# EAGLE design DiamondOutreach (EAGLE 7.6.0)
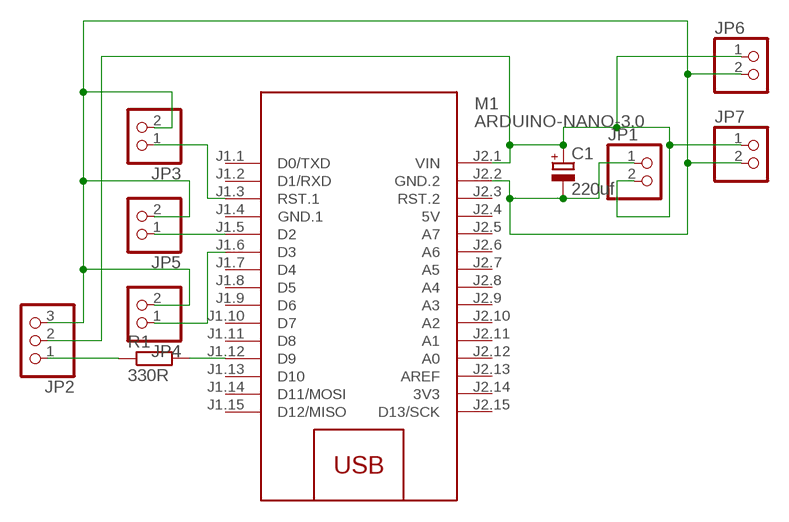
[diagram p0: schematic, sheet 1]

## Parts
C1  220uf  CPOL-EUE2,5-6E  [E2,5-6E]
JP1  PINHD-1X2  [1X02]
JP2  PINHD-1X3  [1X03]
JP3  PINHD-1X2  [1X02]
JP4  PINHD-1X2  [1X02]
JP5  PINHD-1X2  [1X02]
JP6  PINHD-1X2  [1X02]
JP7  PINHD-1X2  [1X02]
M1  ARDUINO-NANO-3.0  [ARDUINO-NANO-3.0]
R1  330R  R-EU_0204/7  [0204/7]

## Nets
N$1: M1.J1.12(D9) R1.2
N$2: JP2.1 R1.1
N$3: JP3.1 M1.J1.3(RST.1)
N$4: C1.+ JP1.2 JP2.2 JP6.1 JP7.1 M1.J2.1(VIN)
N$5: JP4.1 M1.J1.6(D3)
N$7: JP5.1 M1.J1.5(D2)
N$8: C1.- JP1.1 JP2.3 JP3.2 JP4.2 JP5.2 JP6.2 JP7.2 M1.J2.2(GND.2)
Unconnected: M1.J1.1(D0/TXD) M1.J1.2(D1/RXD) M1.J1.7(D4) M1.J1.8(D5) M1.J1.9(D6) M1.J1.10(D7) M1.J1.11(D8) M1.J1.13(D10) M1.J1.14(D11/MOSI) M1.J1.15(D12/MISO) M1.J2.3(RST.2) M1.J2.5(A7) M1.J2.6(A6) M1.J2.7(A5) M1.J2.8(A4) M1.J2.9(A3) M1.J2.10(A2) M1.J2.11(A1) M1.J2.12(A0) M1.J2.13(AREF) M1.J2.15(D13/SCK)

## Power pins joined to a net without a drawn wire
3V3: M1.J2.14(3V3)
5V: M1.J2.4(5V)
GND.1: M1.J1.4(GND.1)

## Library data of the parts
C1 = resistor:CPOL-EU: POLARIZED CAPACITOR, European symbol
JP1 JP3-JP7 = pinhead:PINHD-1X2: PIN HEADER
JP2 = pinhead:PINHD-1X3: PIN HEADER
M1 = diy-modules:ARDUINO-NANO-3.0: Arduino Nano 3.0
R1 = rcl:R-EU_: RESISTOR, European symbol

## Board
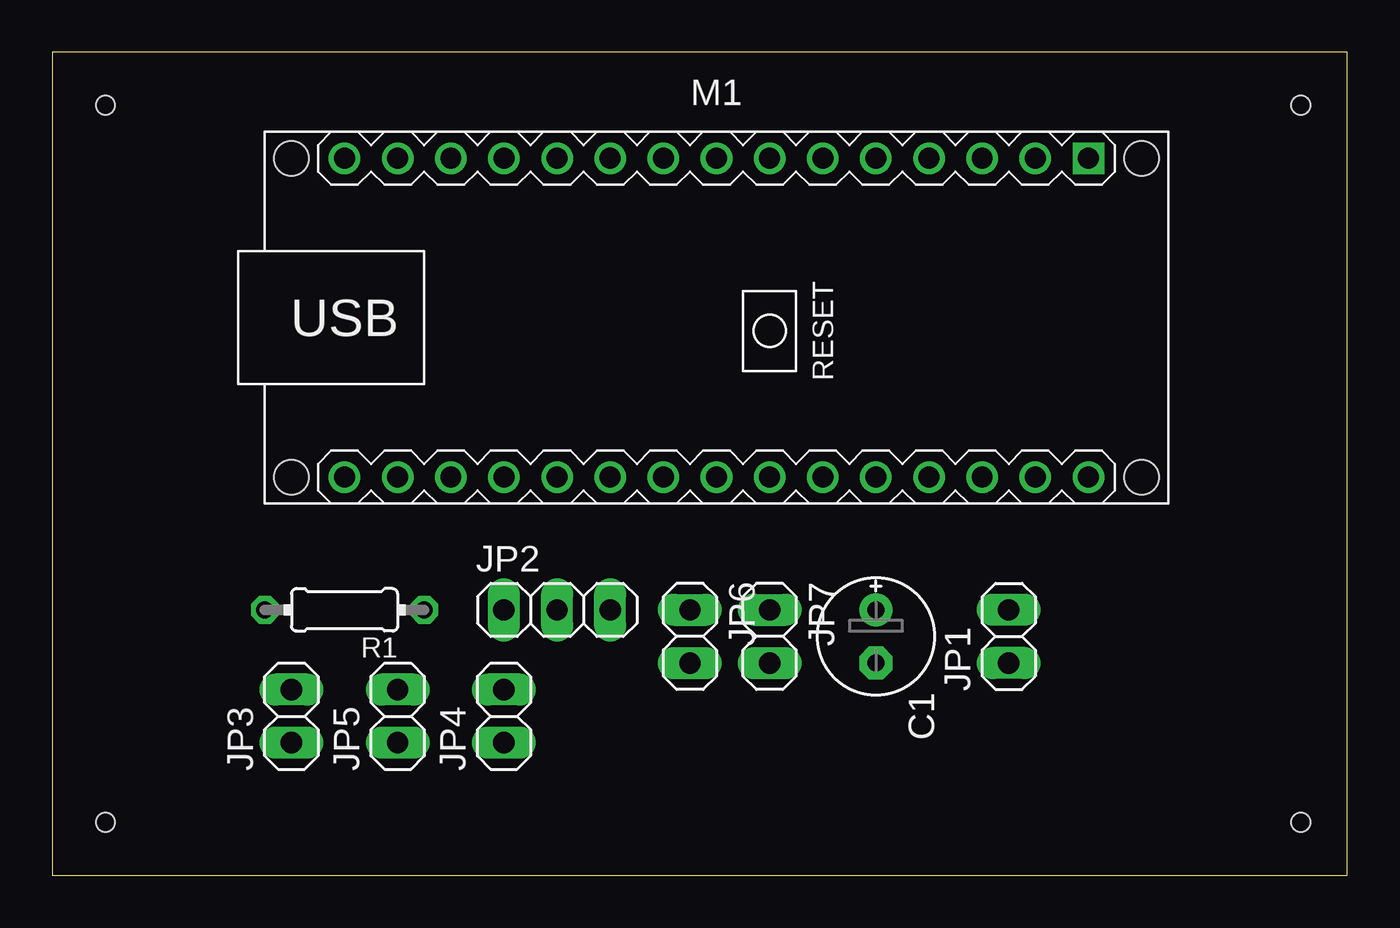
[diagram p1: board, top side]
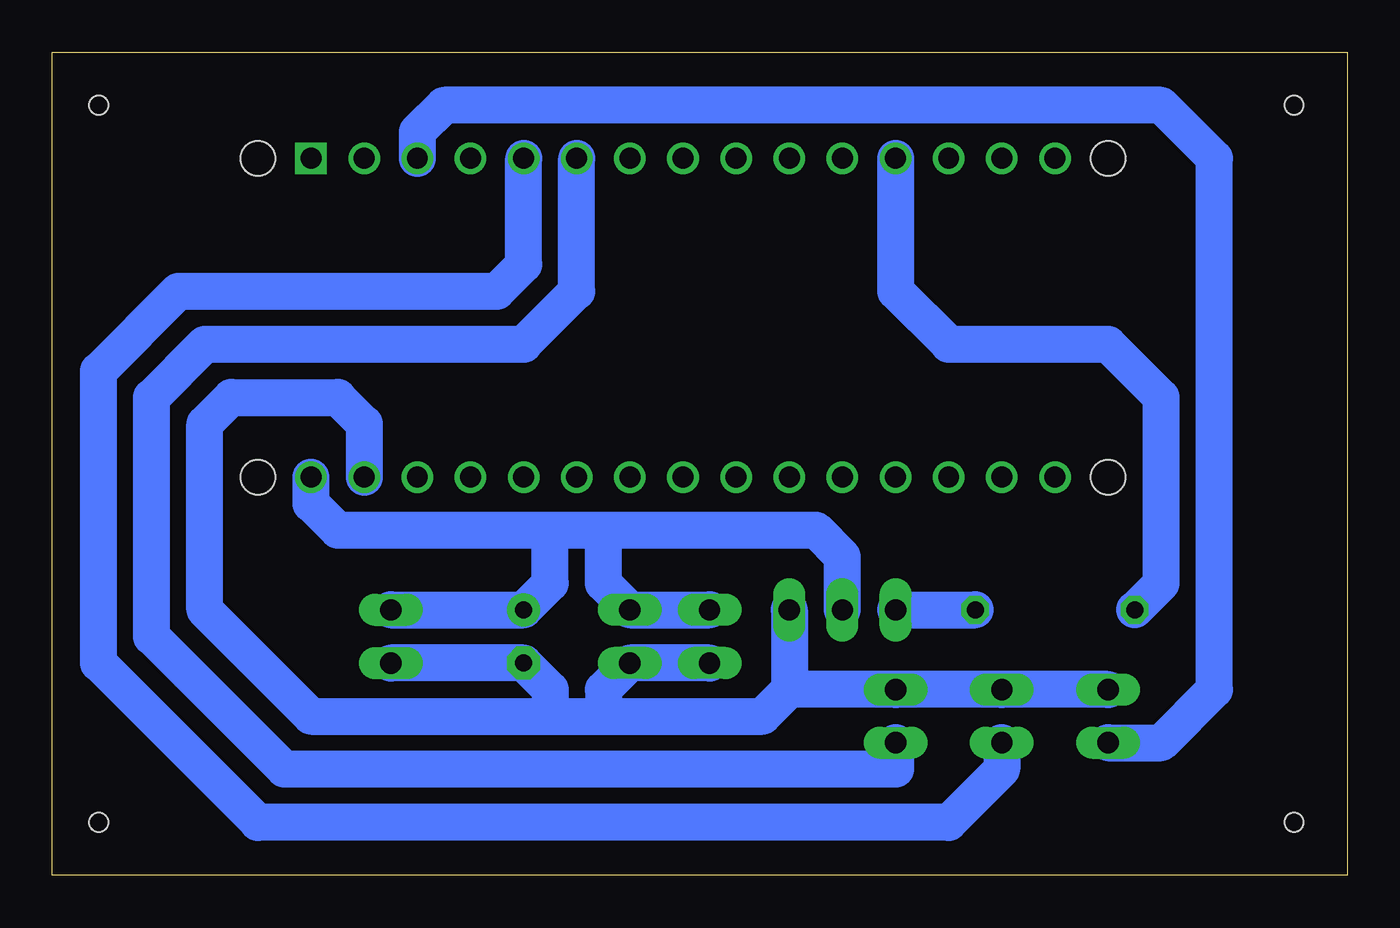
[diagram p2: board, bottom side, seen from below]

Size 61.9 x 39.36 mm. Coordinates in mm from the lower left corner, seen from the top.
Outline: 0,0 61.9,0 61.9,39.36 0,39.36 0,0
Copper layers (1*16): Top 0.035mm / dielectric 1.5mm / Bottom 0.035mm
Design rules "default *": minimum track width 10mil, minimum drill 24mil, track to track 8mil, track to pad 8mil, pad to pad 8mil, via to via 8mil, smd to smd 8mil, copper to edge 40mil, drill to drill 8mil, minimum pad ring 10mil, minimum via ring 8mil, stop-mask expansion 4mil, vias tented up to drill 0mil, thermal gap 10mil
Holes 0.9 mm at 2.54,36.83 2.54,2.54 59.69,2.54 59.69,36.83

### Footprints (pad centres in the part's own frame; a part is rotated, then mirrored left to right if it is on the bottom)
E2,5-6E = drill 0.813 pad 1.575: + -1.27,0 | drill 0.813 pad 1.575 octagon: - 1.27,0
1X02 = drill 1.016 long: 1 -1.27,0; 2 1.27,0
1X03 = drill 1.016 long: 1 -2.54,0; 2 0,0; 3 2.54,0
ARDUINO-NANO-3.0 = drill 1 square: J1.1 17.78,7.62 | drill 1: J1.2 15.24,7.62; J1.3 12.7,7.62; J1.4 10.16,7.62; J1.5 7.62,7.62; J1.6 5.08,7.62; J1.7 2.54,7.62; J1.8 0,7.62; J1.9 -2.54,7.62; J1.10 -5.08,7.62; J1.11 -7.62,7.62; J1.12 -10.16,7.62; J1.13 -12.7,7.62; J1.14 -15.24,7.62; J1.15 -17.78,7.62; J2.1 17.78,-7.62; J2.2 15.24,-7.62; J2.3 12.7,-7.62; J2.4 10.16,-7.62; J2.5 7.62,-7.62; J2.6 5.08,-7.62; J2.7 2.54,-7.62; J2.8 0,-7.62; J2.9 -2.54,-7.62; J2.10 -5.08,-7.62; J2.11 -7.62,-7.62; J2.12 -10.16,-7.62; J2.13 -12.7,-7.62; J2.14 -15.24,-7.62; J2.15 -17.78,-7.62 | hole 1.651: -20.32,7.62; -20.32,-7.62; 20.32,-7.62; 20.32,7.62
0204/7 = drill 0.813 octagon: 1 -3.81,0; 2 3.81,0

### Placement (x,y rotation side)
C1  39.37,11.43 270 top
JP1  45.72,11.43 90 top
JP2  24.13,12.7 0 top
JP3  11.43,7.62 90 top
JP4  21.59,7.62 90 top
JP5  16.51,7.62 90 top
JP6  30.48,11.43 270 top
JP7  34.29,11.43 270 top
M1  31.75,26.67 0 top
R1  13.97,12.7 180 top

### Tracks (layer width: path | path; a pad name or v marks a point on that pad's centre or on a via)
N$1
  Bottom 1.778: M1.J1.12 21.59,27.94 19.05,25.4 11.43,25.4 8.89,22.86 8.89,13.97 R1.2
N$2
  Bottom 1.778: JP2.1 R1.1
N$3
  Bottom 1.778: JP3.1 8.89,6.35 6.35,8.89 6.35,34.29 8.89,36.83 43.18,36.83 44.45,35.56 M1.J1.3
N$4
  Bottom 1.778: JP2.2 24.13,15.24 25.4,16.51 35.56,16.51 | JP1.2 C1.+ 38.1,13.97 38.1,16.51 | 38.1,16.51 48.26,16.51 49.53,17.78 M1.J2.1 | 38.1,16.51 35.56,16.51 | JP6.1 JP7.1 35.56,13.97 35.56,16.51
N$5
  Bottom 1.778: JP4.1 21.59,5.08 50.8,5.08 57.15,11.43 57.15,22.86 54.61,25.4 39.37,25.4 36.83,27.94 M1.J1.6
N$7
  Bottom 1.778: JP5.1 16.51,5.08 19.05,2.54 52.07,2.54 59.69,10.16 59.69,24.13 55.88,27.94 40.64,27.94 39.37,29.21 M1.J1.5
N$8
  Bottom 1.778: M1.J2.2 46.99,21.59 48.26,22.86 53.34,22.86 54.61,21.59 54.61,12.7 49.53,7.62 38.1,7.62 | JP1.1 C1.- 38.1,8.89 38.1,7.62 | 26.67,8.89 JP4.2 JP3.2 JP5.2 | JP2.3 26.67,8.89 | 38.1,7.62 35.56,7.62 | 35.56,7.62 27.94,7.62 26.67,8.89 | JP6.2 JP7.2 35.56,8.89 35.56,7.62